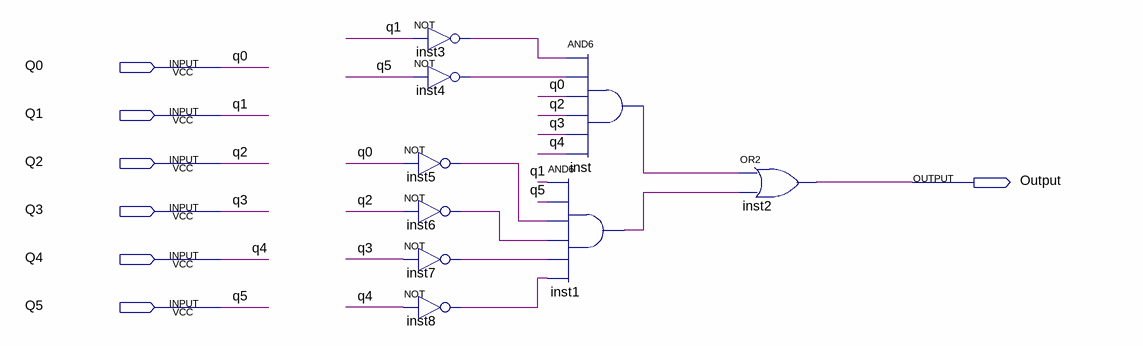
[diagram p0: schematic sheet]
// Quartus schematic Comparador.bdf as structural Verilog: 9 symbols, 7 pins
module Comparador (
  input  Q0,
  input  Q1,
  input  Q2,
  input  Q3,
  input  Q4,
  input  Q5,
  output Output
);

  wire inst1_out, inst3_out, inst4_out, inst5_out, inst6_out, inst7_out, inst8_out, inst_out;

  not inst3 (inst3_out, Q1);
  not inst4 (inst4_out, Q5);
  not inst5 (inst5_out, Q0);
  not inst6 (inst6_out, Q2);
  not inst7 (inst7_out, Q3);
  not inst8 (inst8_out, Q4);
  and inst (inst_out, inst3_out, inst4_out, Q0, Q2, Q3, Q4);
  and inst1 (inst1_out, Q1, Q5, inst5_out, inst6_out, inst7_out, inst8_out);
  or inst2 (Output, inst_out, inst1_out);
endmodule
